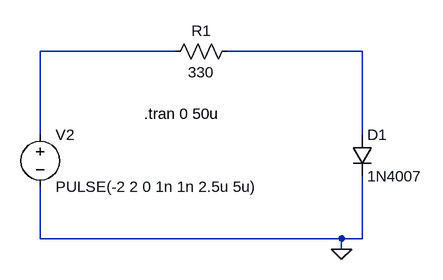
[diagram p0: schematic 1diode.asc]
1diode.asc, the LTspice schematic file:
Version 4
SHEET 1 880 680
WIRE 352 208 144 208
WIRE 640 208 432 208
WIRE 144 336 144 208
WIRE 640 336 640 208
WIRE 144 496 144 416
WIRE 608 496 144 496
WIRE 640 496 640 400
WIRE 640 496 608 496
WIRE 608 512 608 496
FLAG 608 512 0
SYMBOL Res 448 192 R90
WINDOW 0 0 56 VBottom 2
WINDOW 3 32 56 VTop 2
SYMATTR InstName R1
SYMATTR Value 330
SYMBOL Voltage 144 320 R0
SYMATTR InstName V2
SYMATTR Value PULSE(-2 2 0 1n 1n 2.5u 5u)
SYMBOL diode 624 336 R0
SYMATTR InstName D1
SYMATTR Value 1N4007
TEXT 304 304 Left 2 !.tran 0 50u

The netlist it stands for:
* 1diode.asc
R1 N002 N001 330
V2 N001 0 PULSE(-2 2 0 1n 1n 2.5u 5u)
D1 N002 0 1N4007
.model D D
.lib standard.dio
.tran 0 50u
.backanno
.end